# Altium schematic sheet Power.SchDoc: F1C100S-Power
size A4
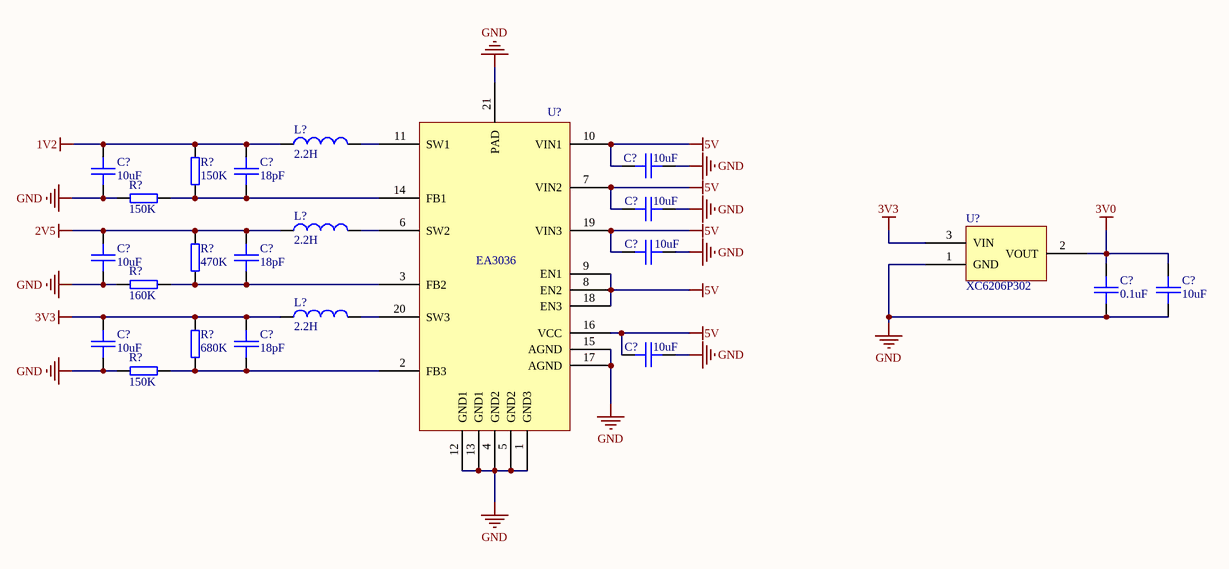
[diagram p0: Power.SchDoc]

## Parts
(Parts that share a designator on the sheet are numbered #1, #2 ... from top to bottom, then left to right.)
C?#1  10uF  [CAP-1206]
C?#2  18pF  [CAP-0603]
C?#3  10uF  [CAP-1206]
C?#4  10uF  [CAP-1206]
C?#5  10uF  [CAP-1206]
C?#6  10uF  [CAP-1206]
C?#7  18pF  [CAP-0603]
C?#8  0.1uF  [CAP-0603]
C?#9  10uF  [CAP-1206]
C?#10  10uF  [CAP-1206]
C?#11  18pF  [CAP-0603]
C?#12  10uF  [CAP-1206]
L?#1  2.2H  [L-PWR-6028]
L?#2  2.2H  [L-PWR-6028]
L?#3  2.2H  [L-PWR-6028]
R?#1  150K  [RES-0603]
R?#2  150K  [RES-0603]
R?#3  470K  [RES-0603]
R?#4  160K  [RES-0603]
R?#5  680K  [RES-0603]
R?#6  150K  [RES-0603]
U?#1  EA3036  [QFN20-3X3]
U?#2  XC6206P302  [SOT-23-3L]

## Nets
1V2: C?#1.2 C?#2.1 L?#1.1 R?#1.2
2V5: C?#6.2 C?#7.1 L?#2.1 R?#3.2
3V0: C?#8.1 C?#9.1 U?#2.2(VOUT)
3V3: C?#10.2 C?#11.1 L?#3.1 R?#5.2 U?#2.3(VIN)
5V: C?#3.2 C?#4.2 C?#5.2 C?#12.2 U?#1.7(VIN2) U?#1.8(EN2) U?#1.9(EN1) U?#1.10(VIN1) U?#1.16(VCC) U?#1.18(EN3) U?#1.19(VIN3)
GND: C?#1.1 C?#3.1 C?#4.1 C?#5.1 C?#6.1 C?#8.2 C?#9.2 C?#10.1 C?#12.1 R?#2.2 R?#4.2 R?#6.2 U?#1.1(GND3) U?#1.4(GND2) U?#1.5(GND2) U?#1.12(GND1) U?#1.13(GND1) U?#1.15(AGND) U?#1.17(AGND) U?#1.21(PAD) U?#2.1(GND)
NetC?#2_2: C?#2.2 R?#1.1 R?#2.1 U?#1.14(FB1)
NetC?#7_2: C?#7.2 R?#3.1 R?#4.1 U?#1.3(FB2)
NetC?#11_2: C?#11.2 R?#5.1 R?#6.1 U?#1.2(FB3)
NetL?#1_2: L?#1.2 U?#1.11(SW1)
NetL?#2_2: L?#2.2 U?#1.6(SW2)
NetL?#3_2: L?#3.2 U?#1.20(SW3)

## Notes on the sheet
- Title
- Size:
- Date:
- A4
- Number:
- Time:
- Revision:
- Sheet
- of
- File:

## Library data of the parts
C?#1 C?#3-C?#6 C?#9 C?#10 C?#12 = C_1206: 陶瓷贴片电容1206; tolerance: 10%; voltage: 50V; C_value: 10uF
C?#2 C?#7 C?#8 C?#11 = C_0603: 陶瓷贴片电容0603; tolerance: 10%; voltage: 50V; ESR: 1.73mOhm; IRMS: 5.59A; Series: X7R
  C?#2 C?#7 C?#11: C_value: 18pF
  C?#8: C_value: 0.1uF
L?#1-L?#3 = L_Power: 功率电感; DCR: 0.1Ohm; IDC: 2.7A; tolerance: 20%; L_value: 2.2H
R?#1-R?#6 = R_0603: 贴片电阻0603; tolerance: 5%; voltage: 50V; power: 0.063W
  R?#1 R?#2 R?#6: R_value: 150K
  R?#3: R_value: 470K
  R?#4: R_value: 160K
  R?#5: R_value: 680K
U?#1 = EA3036: 3CH Power Management IC
U?#2 = XC6206: XC6206 LDO=3V